# EAGLE schematic Nusbio1.0.Light (EAGLE 7.6.0)
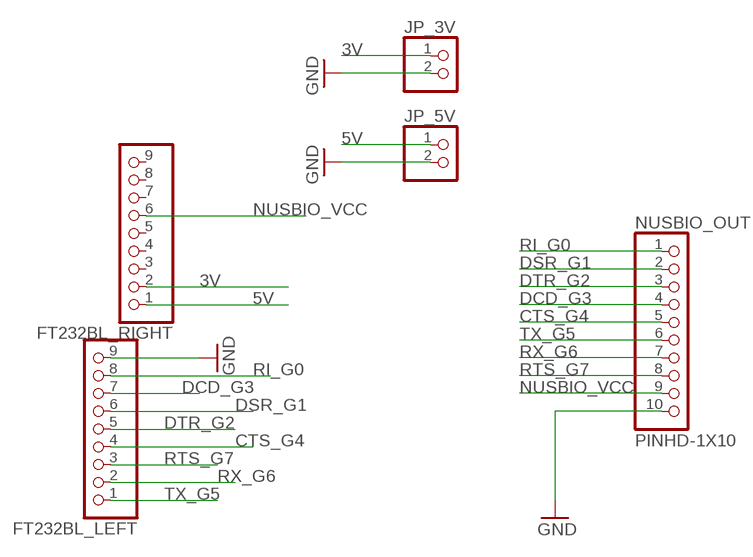
[diagram p0: schematic, sheet 1]

## Parts
FT232BL_LEFT  PINHD-1X9  [1X09-BIG]
FT232BL_RIGHT  PINHD-1X9  [1X09-BIG]
JP_3V  PINHD-1X2  [1X02]
JP_5V  PINHD-1X2  [1X02]
NUSBIO_OUT  PINHD-1X10  [1X10-BIG]

## Nets
3V: FT232BL_RIGHT.2 JP_3V.1
5V: FT232BL_RIGHT.1 JP_5V.1
CTS_G4: FT232BL_LEFT.4 NUSBIO_OUT.5
DCD_G3: FT232BL_LEFT.7 NUSBIO_OUT.4
DSR_G1: FT232BL_LEFT.6 NUSBIO_OUT.2
DTR_G2: FT232BL_LEFT.5 NUSBIO_OUT.3
GND: FT232BL_LEFT.9 JP_3V.2 JP_5V.2 NUSBIO_OUT.10
NUSBIO_VCC: FT232BL_RIGHT.6 NUSBIO_OUT.9
RI_G0: FT232BL_LEFT.8 NUSBIO_OUT.1
RTS_G7: FT232BL_LEFT.3 NUSBIO_OUT.8
RX_G6: FT232BL_LEFT.2 NUSBIO_OUT.7
TX_G5: FT232BL_LEFT.1 NUSBIO_OUT.6
Unconnected: FT232BL_RIGHT.3 FT232BL_RIGHT.4 FT232BL_RIGHT.5 FT232BL_RIGHT.7 FT232BL_RIGHT.8 FT232BL_RIGHT.9

## Library data of the parts
FT232BL_LEFT FT232BL_RIGHT = adafruit:PINHD-1X9: Pin header 1x10 0.1" spacing With round pins
JP_3V JP_5V = pinhead:PINHD-1X2: PIN HEADER
NUSBIO_OUT = adafruit:PINHD-1X10: Pin header 1x10 0.1" spacing With round pins